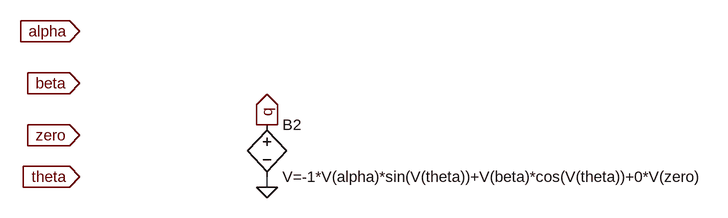
[diagram p0: schematic alphabeta-dq.asc]
alphabeta-dq.asc, the LTspice schematic file:
Version 4
SHEET 1 1192 680
WIRE 416 368 416 352
FLAG 128 128 alpha
IOPIN 128 128 In
FLAG 128 208 beta
IOPIN 128 208 In
FLAG 128 288 zero
IOPIN 128 288 In
FLAG 128 352 theta
IOPIN 128 352 In
FLAG 416 368 0
FLAG 416 272 q
IOPIN 416 272 Out
SYMBOL bv 416 256 R0
SYMATTR InstName B2
SYMATTR Value V=-1*V(alpha)*sin(V(theta))+V(beta)*cos(V(theta))+0*V(zero)

The netlist it stands for:
* alphabeta-dq.asc
B2 q 0 V=-1*V(alpha)*sin(V(theta))+V(beta)*cos(V(theta))+0*V(zero)
.backanno
.end